# EasyEDA Pro project ProPrj_RF Nano Funbots_2025-01-09.epro

# Schematic Schematic1
Board Name: Board1; Create Date: 2025-01-06; Page Name: P1; Project Name: RF Nano Funbots; Schematic Name: Schematic1; Update Date: 2025-01-06; Company: Kazan Engineering; Page Size: A4; Version: V1.0
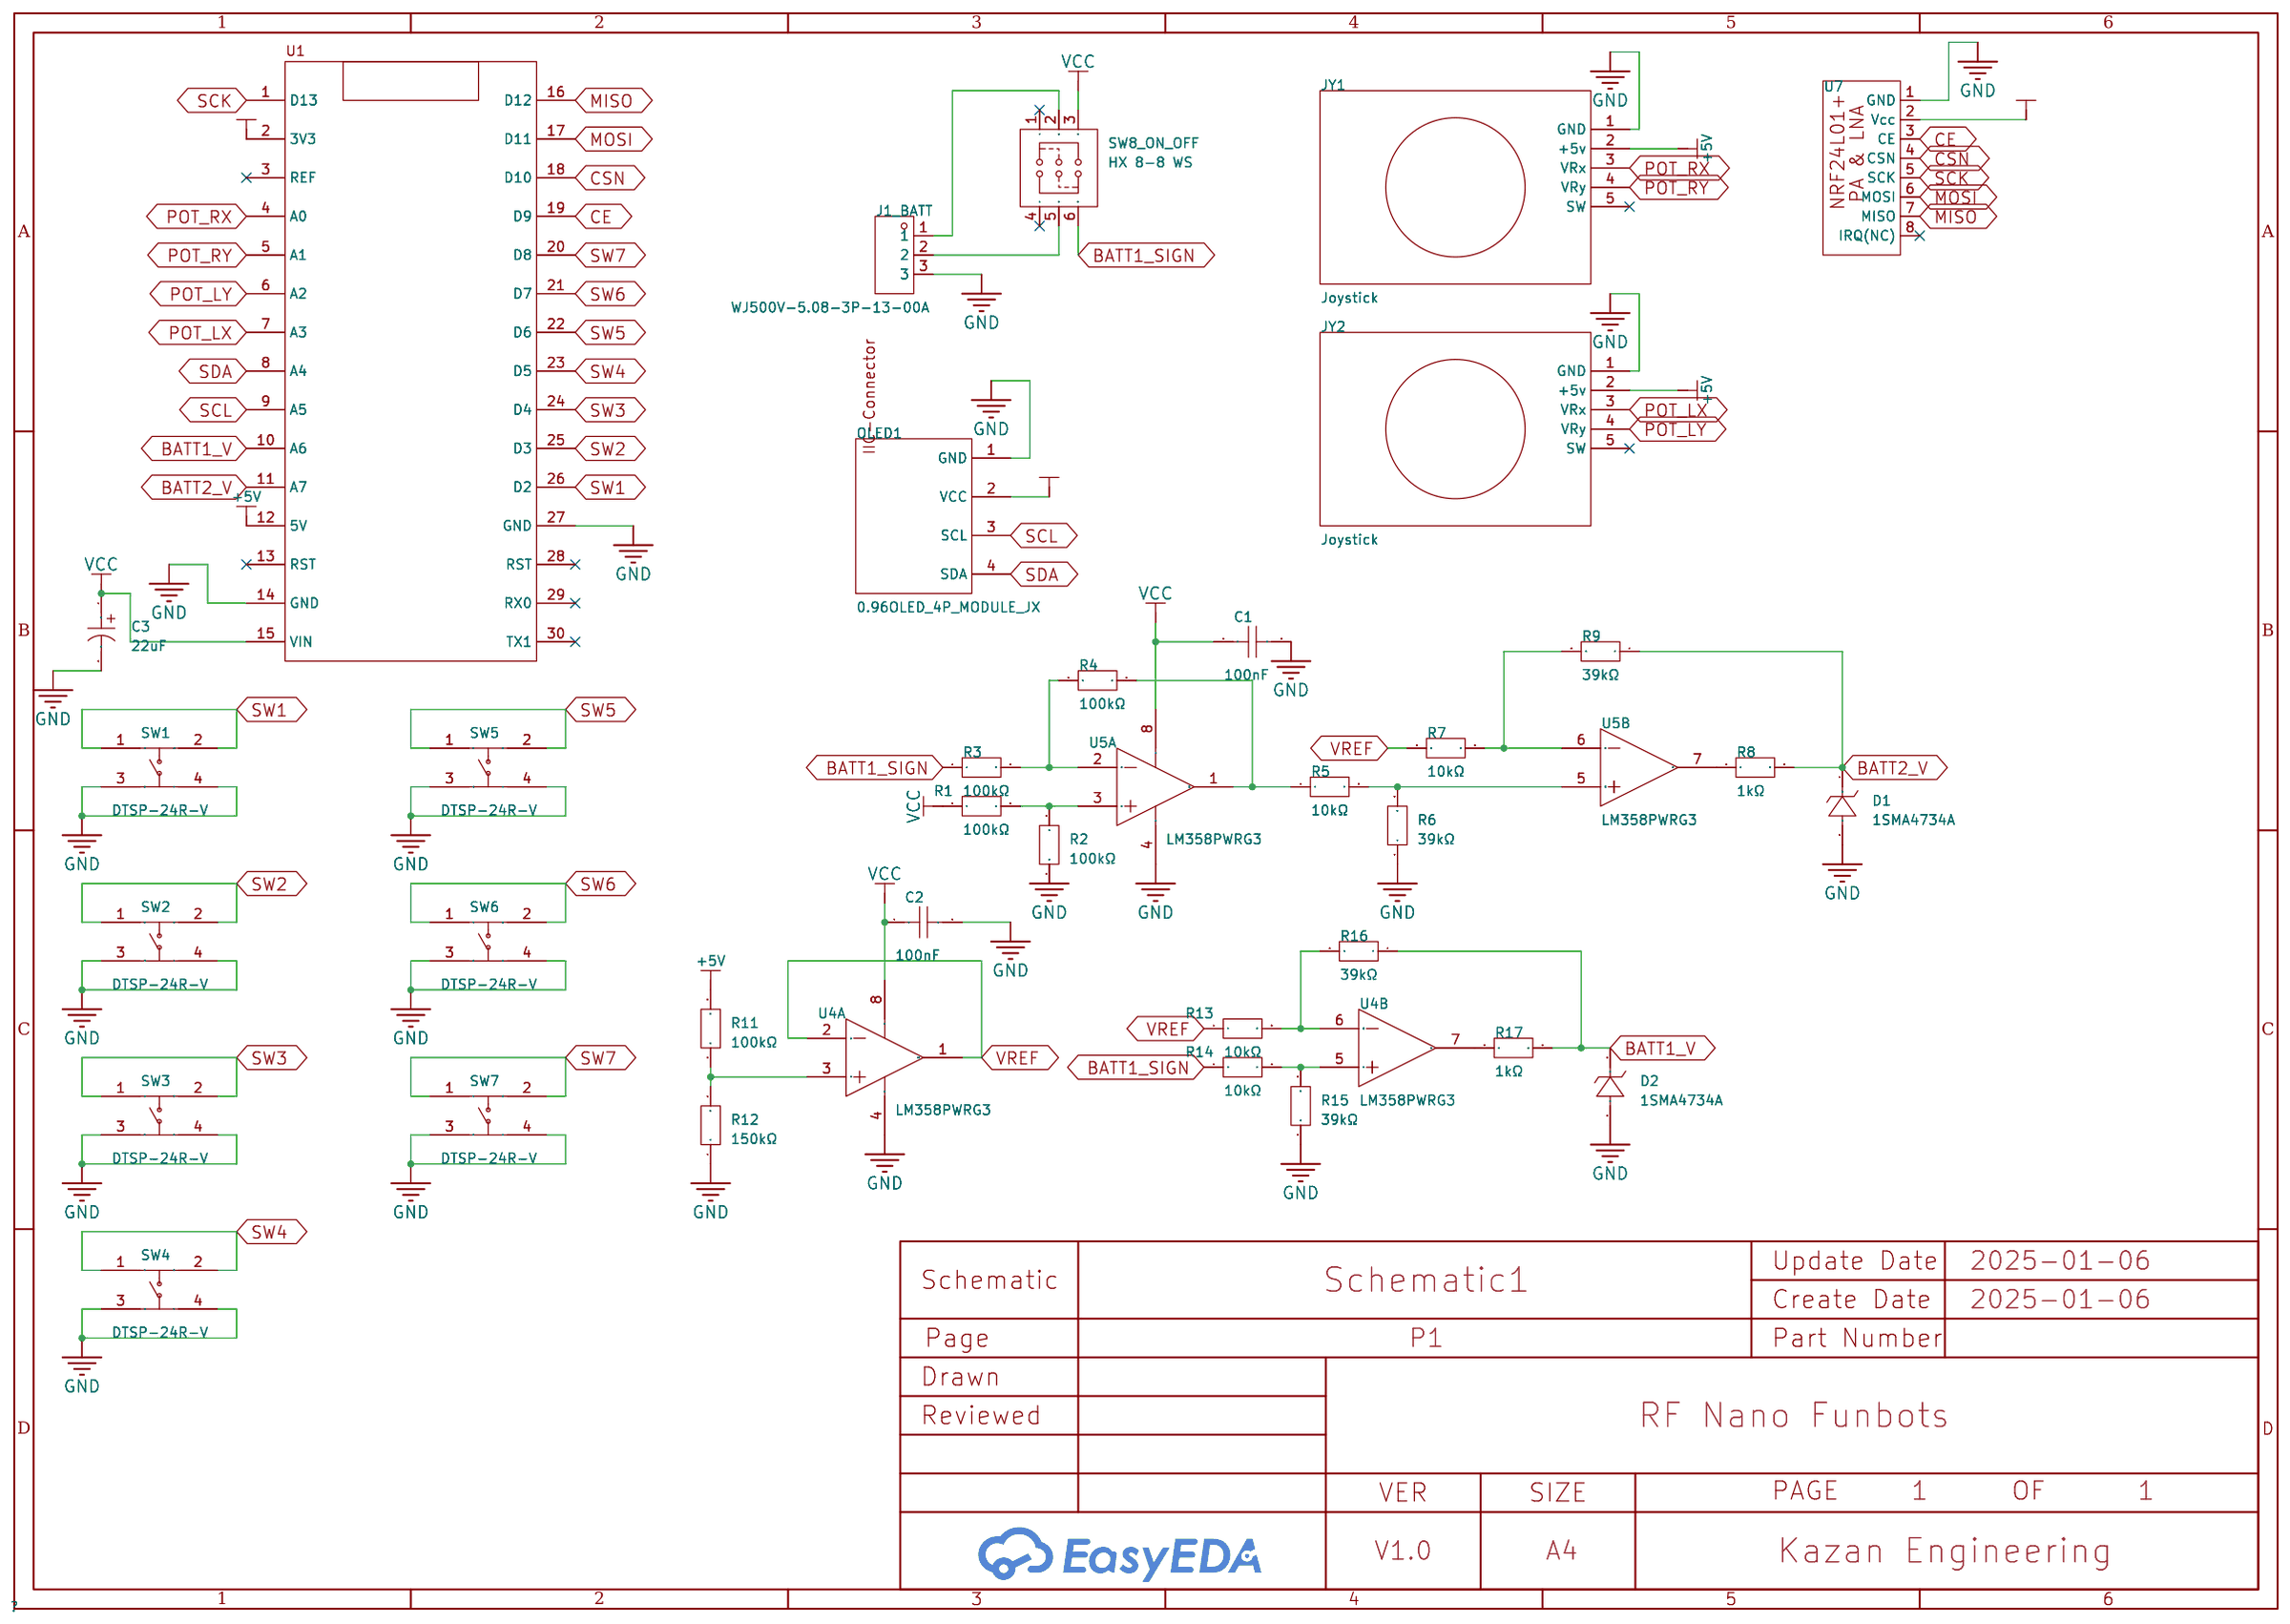
[diagram p0: schematic sheet]

## Parts
C1  100nF  [C0805]
C2  100nF  [C0805]
C3  22uF  [CAP-TH_BD5.0-P2.00-D0.5-FD]
D1  1SMA4734A  [SMA_L4.3-W2.6-LS5.1-RD]
D2  1SMA4734A  [SMA_L4.3-W2.6-LS5.1-RD]
J1_BATT  WJ500V-5.08-3P-13-00A  [CONN-TH_3P-P5.00_WJ500V-5.08-3P]
JY1  Joystick  [JOYSTICK-2AXIS-BUTTON]
JY2  Joystick  [JOYSTICK-2AXIS-BUTTON]
OLED1  0.96OLED_4P_MODULE_JX  [0.96OLED_4P]
R1  100kΩ  [R0402]
R2  100kΩ  [R0402]
R3  100kΩ  [R0402]
R4  100kΩ  [R0402]
R5  10kΩ  [R1206]
R6  39kΩ  [R1206]
R7  10kΩ  [R1206]
R8  1kΩ  [R0402]
R9  39kΩ  [R1206]
R11  100kΩ  [R0402]
R12  150kΩ  [R0603]
R13  10kΩ  [R1206]
R14  10kΩ  [R1206]
R15  39kΩ  [R1206]
R16  39kΩ  [R1206]
R17  1kΩ  [R0402]
SW1  DTSP-24R-V  [SW-TH_4P-L12.0-W12.0-P5.00-LS13.0-EH]
SW2  DTSP-24R-V  [SW-TH_4P-L12.0-W12.0-P5.00-LS13.0-EH]
SW3  DTSP-24R-V  [SW-TH_4P-L12.0-W12.0-P5.00-LS13.0-EH]
SW4  DTSP-24R-V  [SW-TH_4P-L12.0-W12.0-P5.00-LS13.0-EH]
SW5  DTSP-24R-V  [SW-TH_4P-L12.0-W12.0-P5.00-LS13.0-EH]
SW6  DTSP-24R-V  [SW-TH_4P-L12.0-W12.0-P5.00-LS13.0-EH]
SW7  DTSP-24R-V  [SW-TH_4P-L12.0-W12.0-P5.00-LS13.0-EH]
SW8_ON_OFF  HX 8-8 WS  [SW-TH_HX-8-8-WS]
U1  -  [COMM-TH_ARDUINO_NANO]
U4  LM358PWRG3  [TSSOP-8_L4.4-W3.0-P0.65-LS6.4-BL]  (sections 1,2)
U5  LM358PWRG3  [TSSOP-8_L4.4-W3.0-P0.65-LS6.4-BL]  (sections 1,2)
U7  -  [NRF24L01+PA+LNA_PCB]

## Library data of the parts
C1 C2 = FCC0805B104K500DT: Capacitance:100nF Tolerance:±10% Tolerance:±10% Voltage Rated: Temperature Coefficient:; LCSC Part Name: 100nF ±10% 50V; Supplier Part: C5137467; Manufacturer: FOJAN(富捷); Supplier Footprint: 0805; Datasheet: https://atta.szlcsc.com/upload/public/pdf/source/20220818/0EB3B7FB2F5648AC16609637FBA7DABE.pdf; Supplier: LCSC; Tolerance: ±10%
C3 = CD1101HM220D110T: Capacitance: Tolerance:±20% Tolerance:±20% Lifetime @ Temp:; LCSC Part Name: 22uF 50V ±20%; Supplier Part: C42416525; Manufacturer: 创慧电子; Supplier Footprint: 插件,D5xL11mm; Datasheet: https://atta.szlcsc.com/upload/public/pdf/source/20241107/D3793C1A8461A9D845D47EFB85C96F98.pdf; Supplier: LCSC; Tolerance: ±20%
D1 D2 = 1SMA4734A_1: Diode Configuration:- Zener Voltage (Nom):5.6V Reverse Leakage Current (Ir):10uA@2V Zener Voltage (Range):5.32V~5.92V Zener Voltage (Range):5.32V~5.92V Power Dissipation:1W Zener Impedance (Zzt):5Ω; Supplier Part: C5128847; Manufacturer: YONGYUTAI(永裕泰); Supplier Footprint: SMA; JLCPCB Part Class: Extended Part; Datasheet: https://atta.szlcsc.com/upload/public/pdf/source/20220812/88C2231FD146FB180774253B4B99C115.pdf; Supplier: LCSC; Zener Voltage (Nom): 5.6V; Reverse Leakage Current (Ir): 10uA@2V; Zener Voltage (Range): 5.32V~5.92V; Power Dissipation: 1W; Zener Impedance (Zzt): 5Ω
J1_BATT = WJ500V-5.08-3P-13-00A: LCSC Part Name: 直插  P=5.08mm 3P 可拼接 黑色; Supplier Part: C42377753; Manufacturer: KANGNEX(康奈克斯电气); Supplier Footprint: 插件,P=5.08mm; Datasheet: https://atta.szlcsc.com/upload/public/pdf/source/20241106/B65BE8431F64096104C016AC2C83CE18.pdf; Supplier: LCSC
JY1 JY2 = Joystick
OLED1 = 0.96OLED_4P_MODULE_JX: Supplier Part: C9900004566; Supplier Footprint: 插件; JLCPCB Part Class: Extended Part; Datasheet: https://atta.szlcsc.comnull; Supplier: LCSC
R1-R4 R11 = ERA-2VEB1003X: Type:Thin Film Resistor Resistance:100kΩ Tolerance:±0.1% Tolerance:±0.1% Power(Watts): Temperature Coefficient:±25ppm/℃ Temperature Coefficient:±25ppm/℃ Operating Temperature Range:-55℃~+155℃ Operating Temperature Range:-55℃~+155℃; LCSC Part Name: 100kΩ ±0.1% 100mW 薄膜电阻; Supplier Part: C6549335; Manufacturer: PANASONIC(松下); Supplier Footprint: 0402; JLCPCB Part Class: Extended Part; Datasheet: https://atta.szlcsc.com/upload/public/pdf/source/20240123/8A9EB99FAEF9545D7D789040CDC7A096.pdf; Supplier: LCSC; Type: Thin Film Resistor; Tolerance: ±0.1%; Temperature Coefficient: ±25ppm/℃; Operating Temperature Range: -55℃~+155℃
R5 R7 R13 R14 = FRQ1206J103 TS: Type:Thick Film Resistors Resistance: Tolerance:±5% Tolerance:±5% Power(Watts):250mW Temperature Coefficient:±100ppm/℃ Temperature Coefficient:±100ppm/℃; LCSC Part Name: 厚膜电阻 10kΩ ±5% 250mW; Supplier Part: C7468396; Manufacturer: FOJAN(富捷); Supplier Footprint: 1206; JLCPCB Part Class: Extended Part; Datasheet: https://atta.szlcsc.com/upload/public/pdf/source/20230915/D88BDA77B27A9698C44CA869125B965F.pdf; Supplier: LCSC; Type: Thick Film Resistors; Tolerance: ±5%; Power(Watts): 250mW; Temperature Coefficient: ±100ppm/℃
R6 R9 R15 R16 = RT1206BRD0739KL: Type:Thin Film Resistor Resistance: Tolerance:±0.1% Tolerance:±0.1% Power(Watts):250mW Temperature Coefficient:±25ppm/℃ Temperature Coefficient:±25ppm/℃ Operating Temperature Range:-55℃~+155℃ Operating Temperature Range:-55℃~+155℃; LCSC Part Name: 薄膜电阻 39kΩ ±0.1% 250mW; Supplier Part: C870700; Manufacturer: YAGEO(国巨); Supplier Footprint: 1206; JLCPCB Part Class: Extended Part; Datasheet: https://atta.szlcsc.com/upload/public/pdf/source/20200610/C326738_5639A9F1B6EB6E4AE2197577D3456E7F.pdf; Supplier: LCSC; Type: Thin Film Resistor; Tolerance: ±0.1%; Power(Watts): 250mW; Temperature Coefficient: ±25ppm/℃; Operating Temperature Range: -55℃~+155℃
R8 R17 = AC0402FR-7W1KL: Type:Thick Film Resistors Resistance: Tolerance:±1% Tolerance:±1% Power(Watts): Temperature Coefficient:±100ppm/℃ Temperature Coefficient:±100ppm/℃ Operating Temperature Range:-55℃~+155℃ Operating Temperature Range:-55℃~+155℃; LCSC Part Name: 厚膜电阻 1kΩ ±1% 125mW; Supplier Part: C5455561; Manufacturer: YAGEO(国巨); Supplier Footprint: 0402; Datasheet: https://atta.szlcsc.com/upload/public/pdf/source/20220104/CEFE4492A80C856C96F5347FFD9BB3EB.pdf; Supplier: LCSC; Type: Thick Film Resistors; Tolerance: ±1%; Temperature Coefficient: ±100ppm/℃; Operating Temperature Range: -55℃~+155℃
R12 = FRC0603F1503TS: Type:Thick Film Resistors Resistance:150kΩ Tolerance:±1% Tolerance:±1% Power(Watts): Overload Voltage (Max): Temperature Coefficient:±100ppm/℃ Temperature Coefficient:±100ppm/℃ Operating Temperature Range:-55℃~+155℃ Operating Temperature Range:-55℃~+155℃; LCSC Part Name: 150kΩ ±1% 100mW 厚膜电阻; Supplier Part: C2906993; Manufacturer: FOJAN(富捷); Supplier Footprint: 0603; Datasheet: https://atta.szlcsc.com/upload/public/pdf/source/20211221/925EC7D7225764EE0046F22065062C87.pdf; Supplier: LCSC; Type: Thick Film Resistors; Tolerance: ±1%; Temperature Coefficient: ±100ppm/℃; Operating Temperature Range: -55℃~+155℃
SW1-SW7 = DTSP-24R-V: Supplier Part: C9900149848; Supplier Footprint: 直插; Supplier: LCSC
SW8_ON_OFF = HX 8-8 WS: Circuit:DPDT Self Lock / No Lock:No lock Actuator Style:Rectangular Plunger Mounting Style:Direct Insert Contact Current:100mA Voltage Rating:30V Actuator/Cap Color:Blue Pin Style:PCPin Operating Force:180gf Mechanical Life:5 Thousand Times; LCSC Part Name: 按键开关8x8 无锁高头 180gf; Supplier Part: C7435562; Manufacturer: hanxia(韩下); Supplier Footprint: DIP; JLCPCB Part Class: Extended Part; Datasheet: https://atta.szlcsc.com/upload/public/pdf/source/20230919/427570A77F7F053E358FE1519CBDD511.pdf; Supplier: LCSC; Circuit: DPDT; Self Lock / No Lock: No lock; Actuator Style: Rectangular Plunger; Mounting Style: Direct Insert; Contact Current: 100mA; Voltage Rating: 30V; Actuator/Cap Color: Blue; Pin Style: PCPin; Operating Force: 180gf; Mechanical Life: 5 Thousand Times
U1 = Arduino Nano
U4 U5 = LM358PWRG3: Number of Circuits:2 Gain Bandwidth Product(GBP):700kHz Slew Rate(SR):0.3V/us Current - Input Bias(Ib):20nA Output Current:40mA Operating Temperature:0℃~+70℃ Operating Temperature:0℃~+70℃; LCSC Part Name: 双路, 30V, 700kHz 运算放大器; Supplier Part: C2057832; Manufacturer: TI(德州仪器); Supplier Footprint: TSSOP-8; JLCPCB Part Class: Extended Part; Datasheet: https://www.ti.com/cn/lit/gpn/lm358ba; Supplier: LCSC; Number of Circuits: 2; Gain Bandwidth Product(GBP): 700kHz; Slew Rate(SR): 0.3V/us; Current - Input Bias(Ib): 20nA; Output Current: 40mA; Operating Temperature: 0℃~+70℃
U7 = NRF24L01+PA+LNA

## Nets
+3.3V: OLED1.2(VCC) U1.2(3V3) U7.2(Vcc)
+5V: JY1.2(+5v) JY2.2(+5v) R11.2 U1.12(5V)
GND: C1.2 C2.2 C3.2 D1.2(A) D2.2(A) J1_BATT.3 JY1.1(GND) JY2.1(GND) OLED1.1(GND) R2.1 R6.1 R12.1 R15.1 SW1.3 SW1.4 SW2.3 SW2.4 SW3.3 SW3.4 SW4.3 SW4.4 SW5.3 SW5.4 SW6.3 SW6.4 SW7.3 SW7.4 U1.14(GND) U1.27(GND) U4.4(V-) U5.4(V-) U7.1(GND)
VCC: C1.1 C2.1 C3.1 R1.1 SW8_ON_OFF.3 U1.15(VIN) U4.8(V+) U5.8(V+)
BATT1_SIGN: R3.1 R14.1 SW8_ON_OFF.6
BATT1_V: D2.1(C) R16.1 R17.2 U1.10(A6)
BATT2_V: D1.1(C) R8.2 R9.1 U1.11(A7)
CE: U1.19(D9) U7.3(CE)
CSN: U1.18(D10) U7.4(CSN)
MISO: U1.16(D12) U7.7(MISO)
MOSI: U1.17(D11) U7.6(MOSI)
POT_LX: JY2.3(VRx) U1.7(A3)
POT_LY: JY2.4(VRy) U1.6(A2)
POT_RX: JY1.3(VRx) U1.4(A0)
POT_RY: JY1.4(VRy) U1.5(A1)
SCK: U1.1(D13) U7.5(SCK)
SCL: OLED1.3(SCL) U1.9(A5)
SDA: OLED1.4(SDA) U1.8(A4)
SW1: SW1.1 SW1.2 U1.26(D2)
SW2: SW2.1 SW2.2 U1.25(D3)
SW3: SW3.1 SW3.2 U1.24(D4)
SW4: SW4.1 SW4.2 U1.23(D5)
SW5: SW5.1 SW5.2 U1.22(D6)
SW6: SW6.1 SW6.2 U1.21(D7)
SW7: SW7.1 SW7.2 U1.20(D8)
VREF: R7.1 R13.1 U4.1(OUT1) U4.2(IN1-)
$1N441: J1_BATT.1 SW8_ON_OFF.2
$1N448: J1_BATT.2 SW8_ON_OFF.5
$1N2066: R1.2 R2.2 U5.3(IN1+)
$1N2117: R3.2 R4.1 U5.2(IN1-)
$1N2163: R4.2 R5.1 U5.1(OUT1)
$1N2490: R5.2 R6.2 U5.5(IN2+)
$1N2592: R7.2 R9.2 U5.6(IN2-)
$1N3273: R11.1 R12.2 U4.3(IN1+)
$1N3522: R14.2 R15.2 U4.5(IN2+)
$1N3534: R13.2 R16.2 U4.6(IN2-)
$1N5756: R8.1 U5.7(OUT2)
$1N5817: R17.1 U4.7(OUT2)

Not connected (* = marked no-connect by the designer): JY1 5(SW)*; JY2 5(SW)*; SW8_ON_OFF 1* 4*; U1 3(REF)* 13(RST)* 28(RST)* 29(RX0)* 30(TX1)*; U7 8(IRQ(NC))*

# Board PCB1
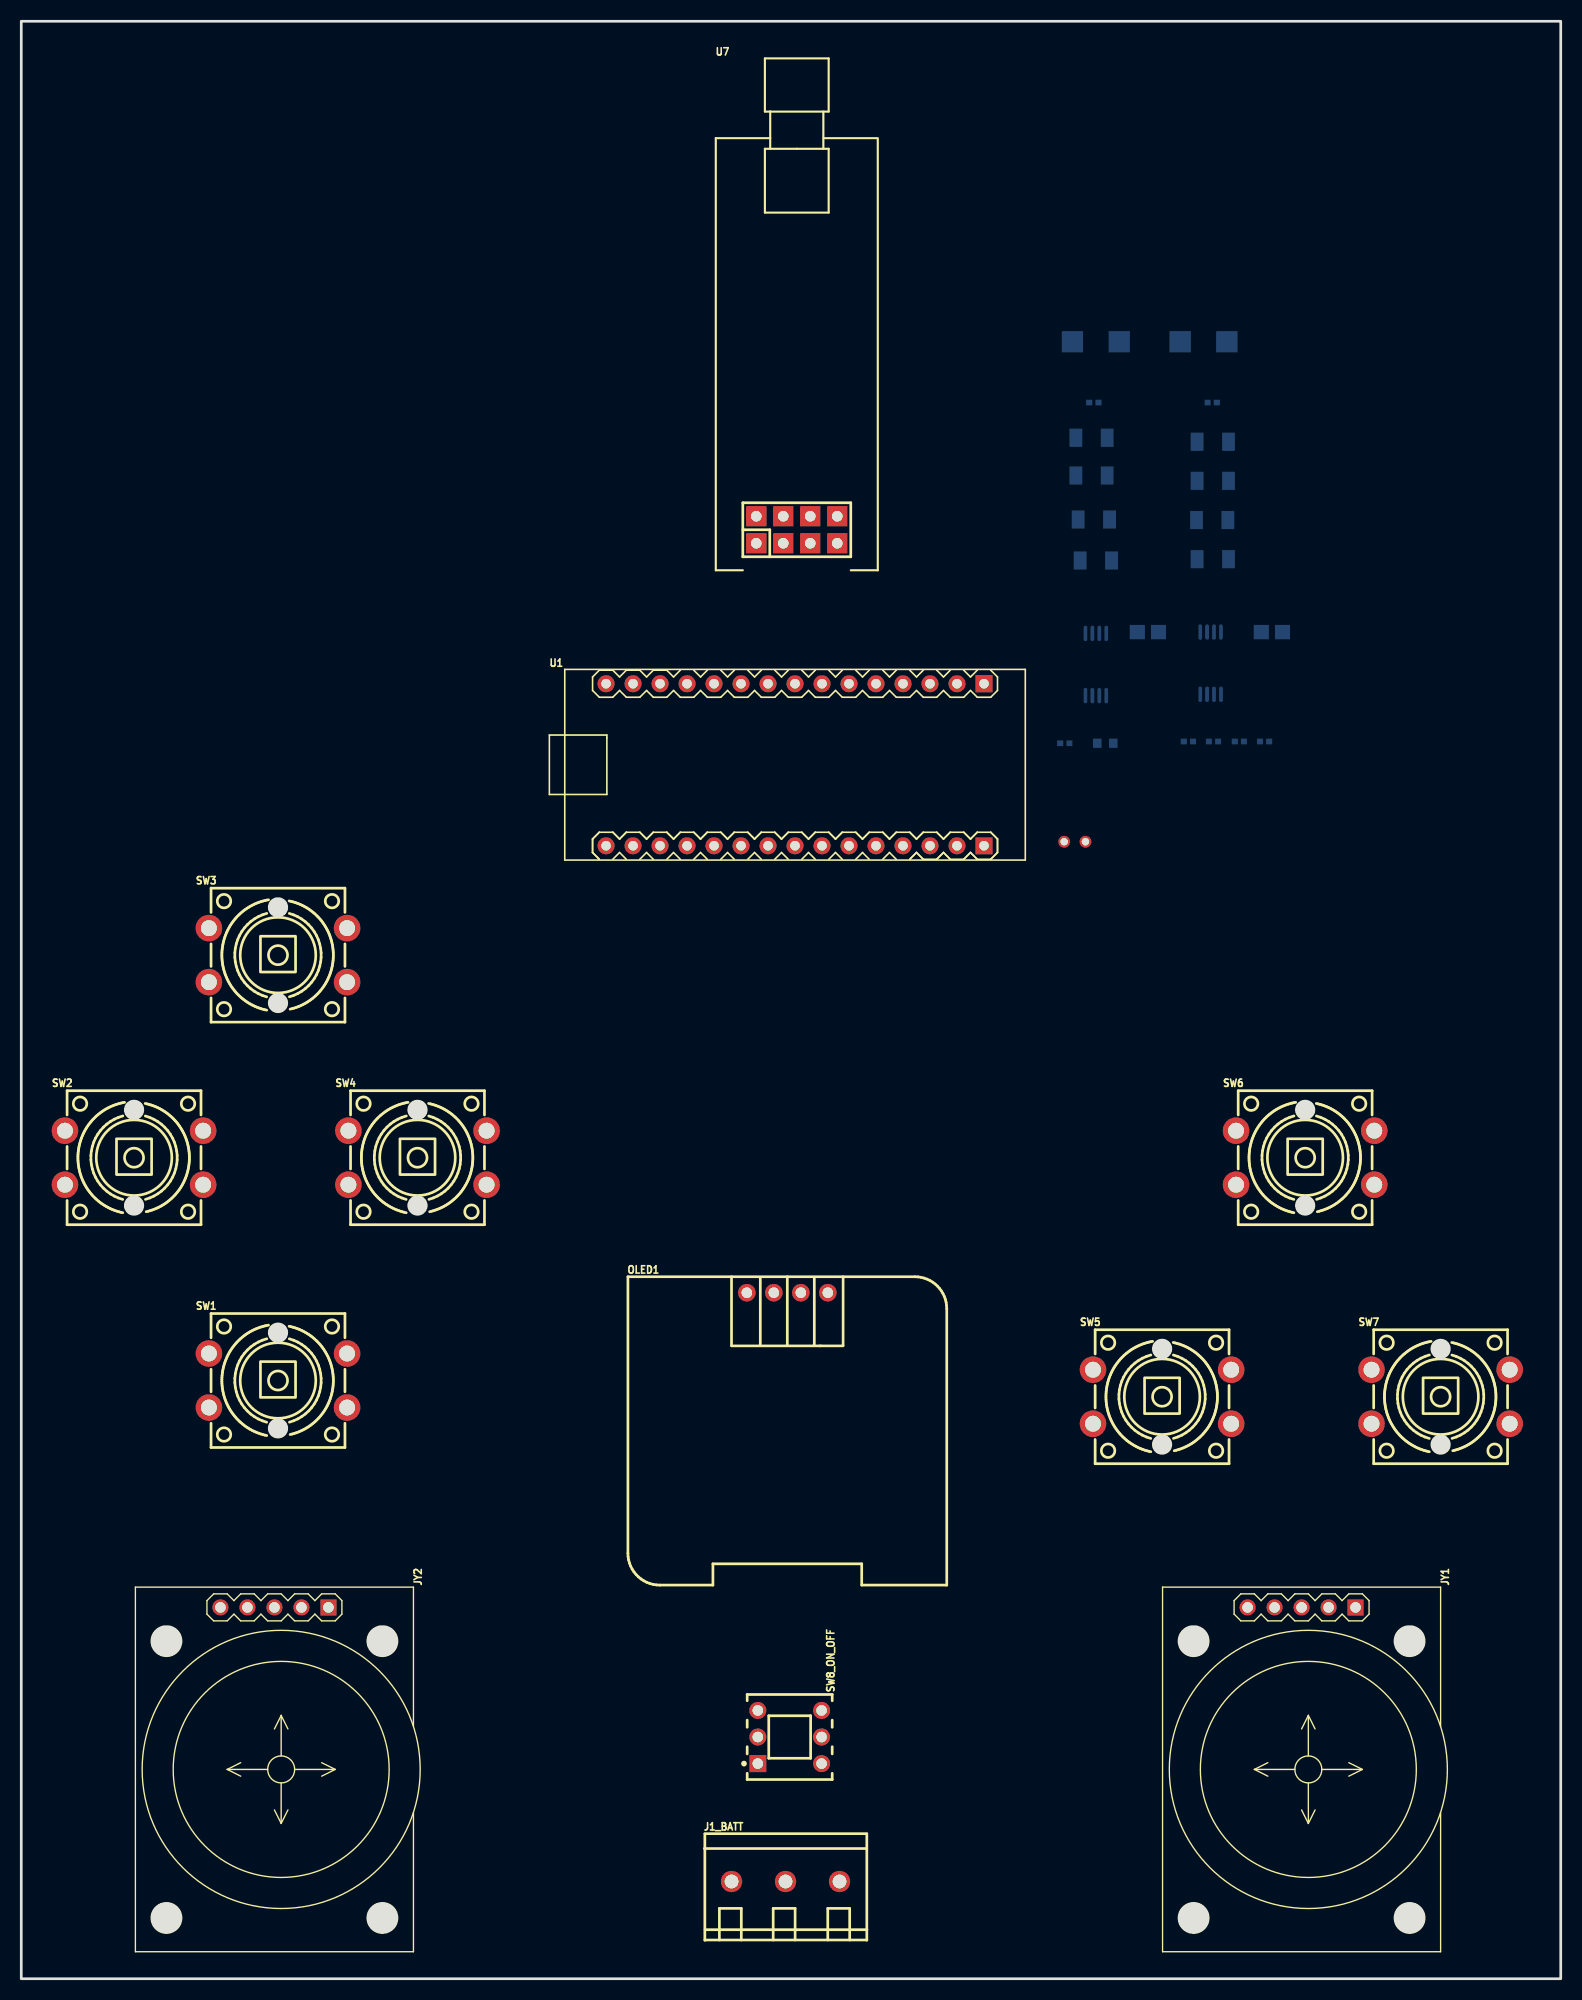
[diagram p1: board, top side]
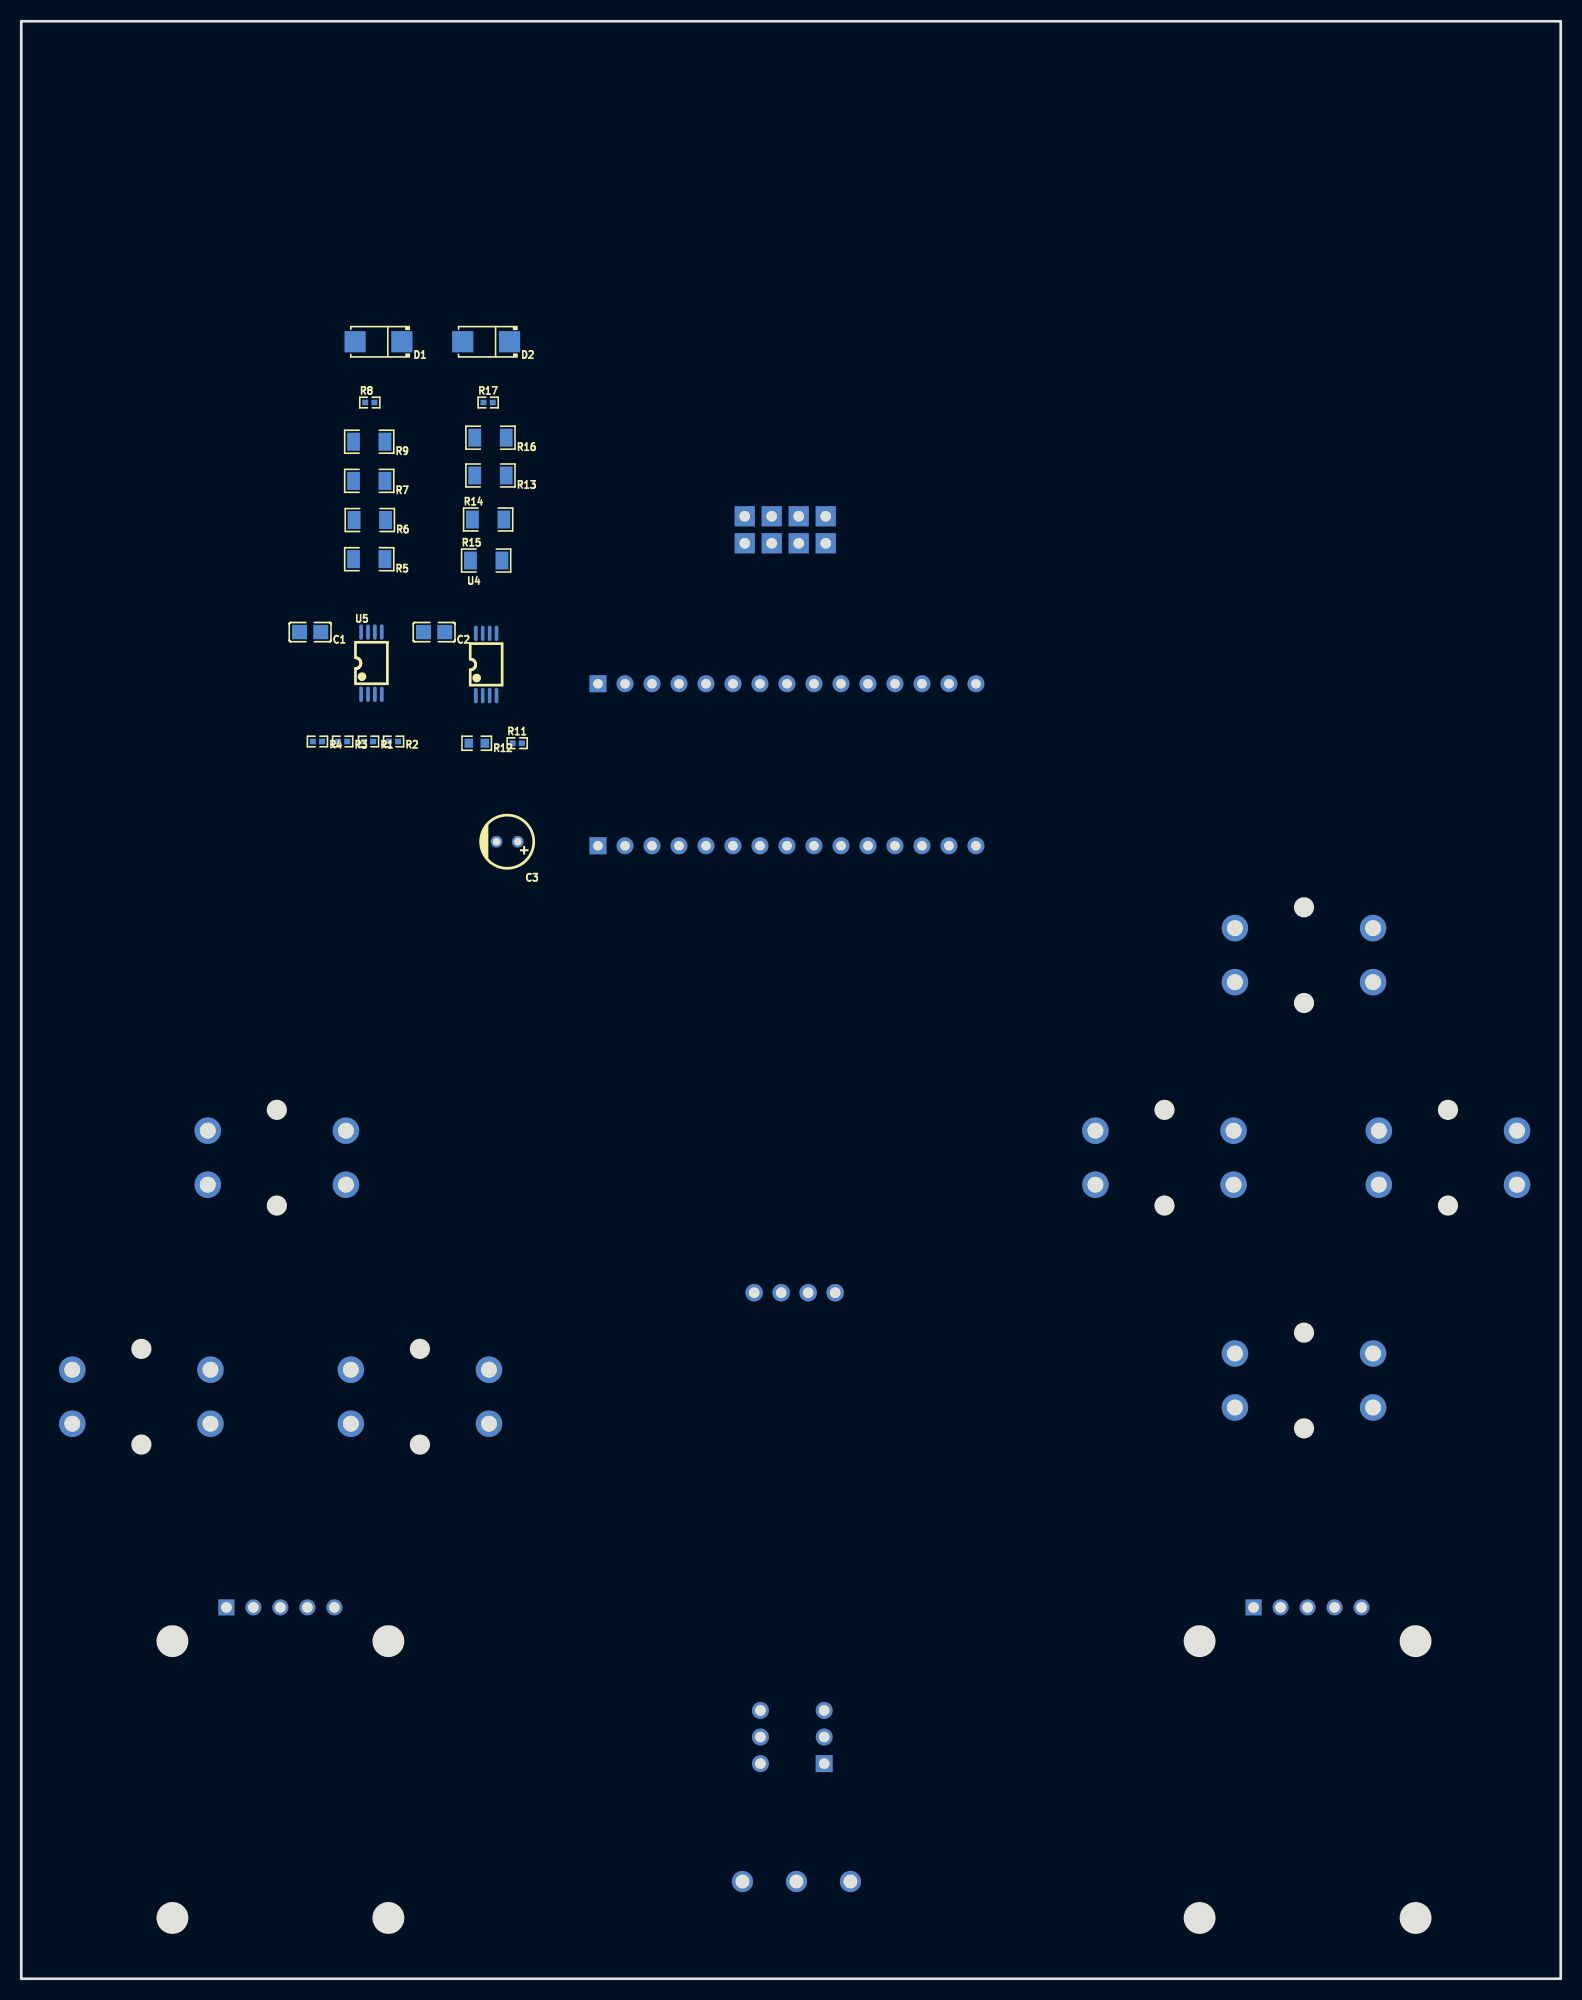
[diagram p2: board, bottom side, seen from below]

Outline 144.85 x 184.09 mm; copper layers: Top Layer, Bottom Layer. Coordinates in mm from the lower left corner of the outline.
Outline path: rectangle 0,184.09 144.85,0
Stack: Top Layer 0.035mm / Dielectric1 1.51mm FR4 er 4.5 / Bottom Layer 0.035mm

## Design rules (mm)
template: JLCPCB Capability(Two Layers Board)
spacing copperThickness1oz (default): track to track 0.102, other pairs 0.152 to 0.3
spacing copperThickness2oz: track to track 0.203, other pairs 0.152 to 0.3
track width copperThickness1oz (default): min 0.127, default 0.254, max 2.54
track width copperThickness2oz: min 0.203, default 0.254, max 2.54
differential pair differentialPair (default): width min 0.127, default 0.254, max 2.54; gap min 0.152, default 0.152
via viaSize (default): diameter min 0.5, default 0.61, max 10; hole min 0.3, default 0.305, max 6.3

## Placement (name value [footprint] x y rotation side)
C1  100nF  [C0805]  117.67 126.65 0 bottom
C2  100nF  [C0805]  106 126.65 0 bottom
C3  22uF  [CAP-TH_BD5.0-P2.00-D0.5-FD]  99.13 106.93 0 bottom
D1  1SMA4734A  [SMA_L4.3-W2.6-LS5.1-RD]  111.24 153.95 0 bottom
D2  1SMA4734A  [SMA_L4.3-W2.6-LS5.1-RD]  101.11 153.95 0 bottom
J1_BATT  WJ500V-5.08-3P-13-00A  [CONN-TH_3P-P5.00_WJ500V-5.08-3P]  71.91 9.14 0 top
JY1  Joystick  [JOYSTICK-2AXIS-BUTTON]  120.47 19.69 270 top
JY2  Joystick  [JOYSTICK-2AXIS-BUTTON]  23.82 19.69 270 top
OLED1  0.96OLED_4P_MODULE_JX  [0.96OLED_4P]  72.08 64.52 0 top
R1  100kΩ  [R0402]  112.18 116.36 0 bottom
R2  100kΩ  [R0402]  109.82 116.36 0 bottom
R3  100kΩ  [R0402]  114.61 116.36 0 bottom
R4  100kΩ  [R0402]  116.98 116.36 0 bottom
R5  10kΩ  [R1206]  112.11 133.51 0 bottom
R6  39kΩ  [R1206]  112.06 137.19 0 bottom
R7  10kΩ  [R1206]  112.11 140.87 0 bottom
R8  1kΩ  [R0402]  112.06 148.24 180 bottom
R9  39kΩ  [R1206]  112.11 144.55 0 bottom
R11  100kΩ  [R0402]  98.19 116.2 180 bottom
R12  150kΩ  [R0603]  102 116.2 0 bottom
R13  10kΩ  [R1206]  100.7 141.38 0 bottom
R14  10kΩ  [R1206]  100.92 137.24 180 bottom
R15  39kΩ  [R1206]  101.11 133.38 180 bottom
R16  39kΩ  [R1206]  100.7 144.94 0 bottom
R17  1kΩ  [R0402]  100.92 148.24 180 bottom
SW1  DTSP-24R-V  [SW-TH_4P-L12.0-W12.0-P5.00-LS13.0-EH]  24.16 56.26 0 top
SW2  DTSP-24R-V  [SW-TH_4P-L12.0-W12.0-P5.00-LS13.0-EH]  10.61 77.22 0 top
SW3  DTSP-24R-V  [SW-TH_4P-L12.0-W12.0-P5.00-LS13.0-EH]  24.16 96.27 0 top
SW4  DTSP-24R-V  [SW-TH_4P-L12.0-W12.0-P5.00-LS13.0-EH]  37.28 77.22 0 top
SW5  DTSP-24R-V  [SW-TH_4P-L12.0-W12.0-P5.00-LS13.0-EH]  107.34 54.74 0 top
SW6  DTSP-24R-V  [SW-TH_4P-L12.0-W12.0-P5.00-LS13.0-EH]  120.8 77.22 0 top
SW7  DTSP-24R-V  [SW-TH_4P-L12.0-W12.0-P5.00-LS13.0-EH]  133.55 54.74 0 top
SW8_ON_OFF  HX 8-8 WS  [SW-TH_HX-8-8-WS]  72.3 22.73 270 top
U1  -  [COMM-TH_ARDUINO_NANO]  72.8 114.17 0 top
U4  LM358PWRG3  [TSSOP-8_L4.4-W3.0-P0.65-LS6.4-BL]  101.11 123.6 180 bottom
U5  LM358PWRG3  [TSSOP-8_L4.4-W3.0-P0.65-LS6.4-BL]  111.9 123.73 180 bottom
U7  -  [NRF24L01+PA+LNA_PCB]  65.35 132.46 0 top

## Footprints (pads in the part's own frame, mm; a bottom-side part is the same pattern mirrored in y, then rotated)
0.96OLED_4P
  round 1.65 hole 1: 1(-3.81,-0.002) 2(-1.27,0.002) 3(1.27,0.002) 4(3.81,0.002)
C0805
  rect 1.41x1.35 smd: 1(-1,0) 2(1,0)
CAP-TH_BD5.0-P2.00-D0.5-FD
  round 1.1 hole 0.7: 1(-1,0) 2(1,0)
COMM-TH_ARDUINO_NANO
  round 1.6 hole 0.9: 1(-17.78,-7.62) 2(-15.24,-7.62) 3(-12.7,-7.62) 4(-10.16,-7.62) 5(-7.62,-7.62) 6(-5.08,-7.62) 7(-2.54,-7.62) 8(0,-7.62) 9(2.54,-7.62) 10(5.08,-7.62) 11(7.62,-7.62) 12(10.16,-7.62) 13(12.7,-7.62) 14(15.24,-7.62) 17(15.24,7.62) 18(12.7,7.62) 19(10.16,7.62) 20(7.62,7.62) 21(5.08,7.62) 22(2.54,7.62) 23(0,7.62) 24(-2.54,7.62) 25(-5.08,7.62) 26(-7.62,7.62) 27(-10.16,7.62) 28(-12.7,7.62) 29(-15.24,7.62) 30(-17.78,7.62)
  rect 1.6x1.6 hole 0.9: 15(17.78,-7.62) 16(17.78,7.62)
CONN-TH_3P-P5.00_WJ500V-5.08-3P
  round 2 hole 1.3: 1(-5.08,0) 2(0,0) 3(5.08,0)
JOYSTICK-2AXIS-BUTTON
  rect 1.508x1.508 hole 1: 1(-15.24,5.08)
  round 1.508 hole 1: 2(-15.24,2.54) 3(-15.24,0) 4(-15.24,-2.54) 5(-15.24,-5.08)
NRF24L01+PA+LNA_PCB
  rect 1.9x1.9 hole 1: 1(3.81,2.54) 2(3.81,5.08) 3(6.35,2.54) 4(6.35,5.08) 5(8.89,2.54) 6(8.89,5.08) 7(11.43,2.54) 8(11.43,5.08)
R0402
  rect 0.566x0.54 smd: 1(-0.433,0) 2(0.433,0)
R0603
  rect 0.806x0.864 smd: 1(-0.753,0) 2(0.753,0)
R1206
  rect 1.208x1.701 smd: 1(-1.479,0) 2(1.479,0)
SMA_L4.3-W2.6-LS5.1-RD
  rect 2x2 smd: 1(-2.2,0) 2(2.2,0)
SW-TH_4P-L12.0-W12.0-P5.00-LS13.0-EH
  round 2.5 hole 1.5: 1(-6.5,2.54) 2(6.5,2.54) 3(-6.5,-2.54) 4(6.5,-2.54)
SW-TH_HX-8-8-WS
  rect 1.6x1.6 hole 1: 1(2.5,-3)
  round 1.6 hole 1: 2(0,-3) 3(-2.5,-3) 4(2.5,3) 5(0,3) 6(-2.5,3)
TSSOP-8_L4.4-W3.0-P0.65-LS6.4-BL
  oval 0.353x1.454 smd: 1(-0.975,-2.927) 2(-0.325,-2.927) 3(0.325,-2.927) 4(0.975,-2.927) 5(0.975,2.927) 6(0.325,2.927) 7(-0.325,2.927) 8(-0.975,2.927)

## Nets
As in the schematic.

Pads without a net: JY1 5; JY2 5; SW8_ON_OFF 1 4; U1 3 13 28 29 30; U7 8
